# Altium project GRHV_30v.PrjPcb
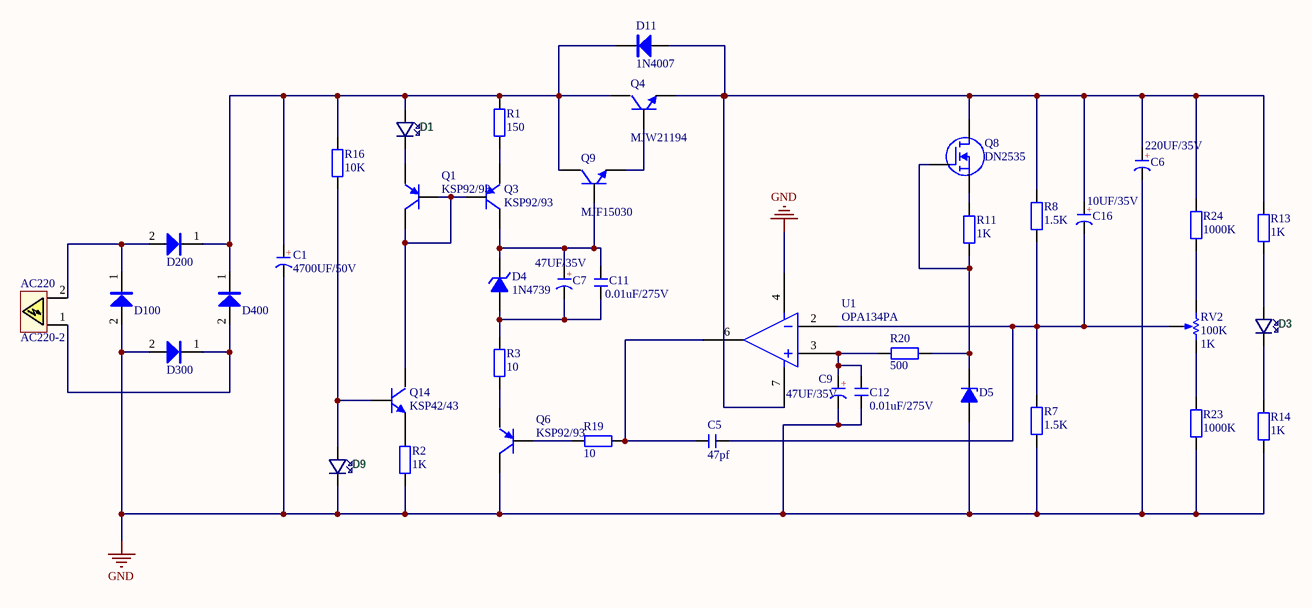
[diagram p0: Sheet2.SchDoc]
1 sheet, 41 parts. Net scope: global (net labels, ports and power ports of the same name join across sheets).
Board file: GRHV_30V_PCB.PcbDoc

## Sheet Sheet2.SchDoc
size A4

### Parts
AC220  AC220-2  [HX5.08-2L]
C1  4700UF/50V  [CAP 10*22*40]
C5  47pf  [CC 2.2*5]
C6  220UF/35V  [CAP 5.0*10*20]
C7  47UF/35V  [CAP 5.0*10*20]
C9  47UF/35V  [CAP 5.0*10*20]
C11  0.01uF/275V  [CBB 6.3*6.3*5]
C12  0.01uF/275V  [CBB 6.3*6.3*5]
C16  10UF/35V  [CAP 5.0*10*20]
D1  (no value)  [LED 3MM-R]
D3  (no value)  [LED 3MM-R]
D4  1N4739  [DO-41]
D5  LT1021-10-2P  [DIP8-300_MH]  (value not drawn)
D9  (no value)  [LED 3MM-R]
D11  1N4007  [DO-41]
D100  VS-HFA08TB60-M3  [TO220AC]  (value not drawn)
D200  VS-HFA08TB60-M3  [TO220AC]  (value not drawn)
D300  VS-HFA08TB60-M3  [TO220AC]  (value not drawn)
D400  VS-HFA08TB60-M3  [TO220AC]  (value not drawn)
Q1  KSP92/93  [TO92A]
Q3  KSP92/93  [TO92A]
Q4  MJW21194  [TO247V]
Q6  KSP92/93  [TO92A]
Q8  DN2535  [TO92A]
Q9  MJF15030  [TO220V]
Q14  KSP42/43  [TO92A]
R1  150  [RS 1/4W]
R2  1K  [RS 1/4W]
R3  10  [RS 1/4W]
R7  1.5K  [RS 1/4W]
R8  1.5K  [RS 1/4W]
R11  1K  [RS 1/4W]
R13  1K  [RS 1/4W]
R14  1K  [RS 1/4W]
R16  10K  [RS 1/4W]
R19  10  [RS 1/4W]
R20  500  [RS 1/4W]
R23  1000K  [RS 1/4W]
R24  1000K  [RS 1/4W]
RV2  100K  value 1K  [VR5]
U1  OPA134PA  [DIP8-300_MH]

### Nets
GND: C1.2(K) C6.2(K) C9.2(K) C12.2 D5.4(A) D9.K D100.2(Anode) D300.2(Anode) Q6.3(C) R2.1 R7.1 R14.1 R23.1 U1.4(V-)
NetAC220_1: AC220.1(L) D300.1(Cathode) D400.2(Anode)
NetAC220_2: AC220.2(G) D100.1(Cathode) D200.2(Anode)
NetC1_1: C1.1(A) D1.A D11.2(K) D200.1(Cathode) D400.1(Cathode) Q4.2(C) Q9.2(C) R1.2 R16.2
NetC5_1: C5.1 R19.1 U1.6(out)
NetC5_2: C5.2 C16.2(K) R7.2 R8.1 RV2.3(TAP) U1.2(-in)
NetC6_1: C6.1(A) C16.1(A) D11.1(A) Q4.3(E) Q8.3(D) R8.2 R13.2 R24.2 U1.7(V+)
NetC7_1: C7.1(A) C11.1 D4.2(K) Q3.3(C) Q9.1(B)
NetC7_2: C7.2(K) C11.2 D4.1(A) R3.2
NetC9_1: C9.1(A) C12.1 R20.2 U1.3(+in)
NetD1_K: D1.K Q1.1(E)
NetD3_A: D3.A R13.1
NetD3_K: D3.K R14.2
NetD5_6: D5.6(K) Q8.2(G) R11.1 R20.1
NetD9_A: D9.A Q14.2(B) R16.1
NetQ1_2: Q1.2(B) Q1.3(C) Q3.2(B) Q14.3(C)
NetQ3_1: Q3.1(E) R1.1
NetQ4_1: Q4.1(B) Q9.3(E)
NetQ6_1: Q6.1(E) R3.1
NetQ6_2: Q6.2(B) R19.2
NetQ8_1: Q8.1(S) R11.2
NetQ14_1: Q14.1(E) R2.2
NetR23_2: R23.2 RV2.2(BOT)
NetR24_1: R24.1 RV2.1(TOP)

### Notes on the sheet
- (in symbol C-CAP) +

### Library data of the parts
C1 C9 = C-CAP: 直插电解电容; 版权归属: 源创客; BOM名称: 直插电解电容; 学习资源: www.ooocke.com
C5 = C-CC: 直插瓷片电容; 版权归属: 源创客; BOM名称: 直插瓷片电容; 学习资源: www.ooocke.com
C6 C7 C16 = C-CAP: 直插电解电容; BOM名称: 直插电解电容
C11 C12 = C-CBB: CBB电容; 版权归属: 源创客; BOM名称: CBB电容; 学习资源: www.ooocke.com
D1 D3 D9 = LED: 直插式LED
D4 = 1N4739: 9.1V/1W稳压管
D5 = LT1021-10-2P: 10V Precision Reference 2 Pin Config
D11 = 1N4007: 整流二极管; BOM名称: 整流二极管
D100 D200 D300 D400 = VS-HFA08TB60-M3: Ultrafast Soft Recovery Diado 8A 600V
Q1 Q3 Q6 = KSP92/93: High Voltage PNP Transistor
Q4 = MJW21194: Power NPN Transistor
Q8 = DN2535: N沟道耗尽型DMOS场效应管
Q9 = MJF15030: Power NPN Transistor
Q14 = KSP42/43: High Voltage NPN Transistor
R1-R3 R7 R8 R11 R13 R19 R20 R23 R24 = R-CRR: 直插色环电阻; BOM名称: 色环电阻
R14 R16 = R-CRR: 直插色环电阻; BOM名称: 色环电阻; 版权归属: 源创客; 学习资源: www.ooocke.com
RV2 = RPot: Potentiometer; Sim Note: Enter the Resistance value and the set point into parameter fields.; Set Position: 0.5; Published: 8-Jun-2000; LatestRevisionDate: 17-Jul-2002; LatestRevisionNote: Re-released for DXP Platform.; PackageReference: VR5; Publisher: Altium Limited; PackageDescription: Variable Resistor, Thru-Hole; 3 Leads